# Altium project ICSL Receiver gede Ver2.PrjPCB
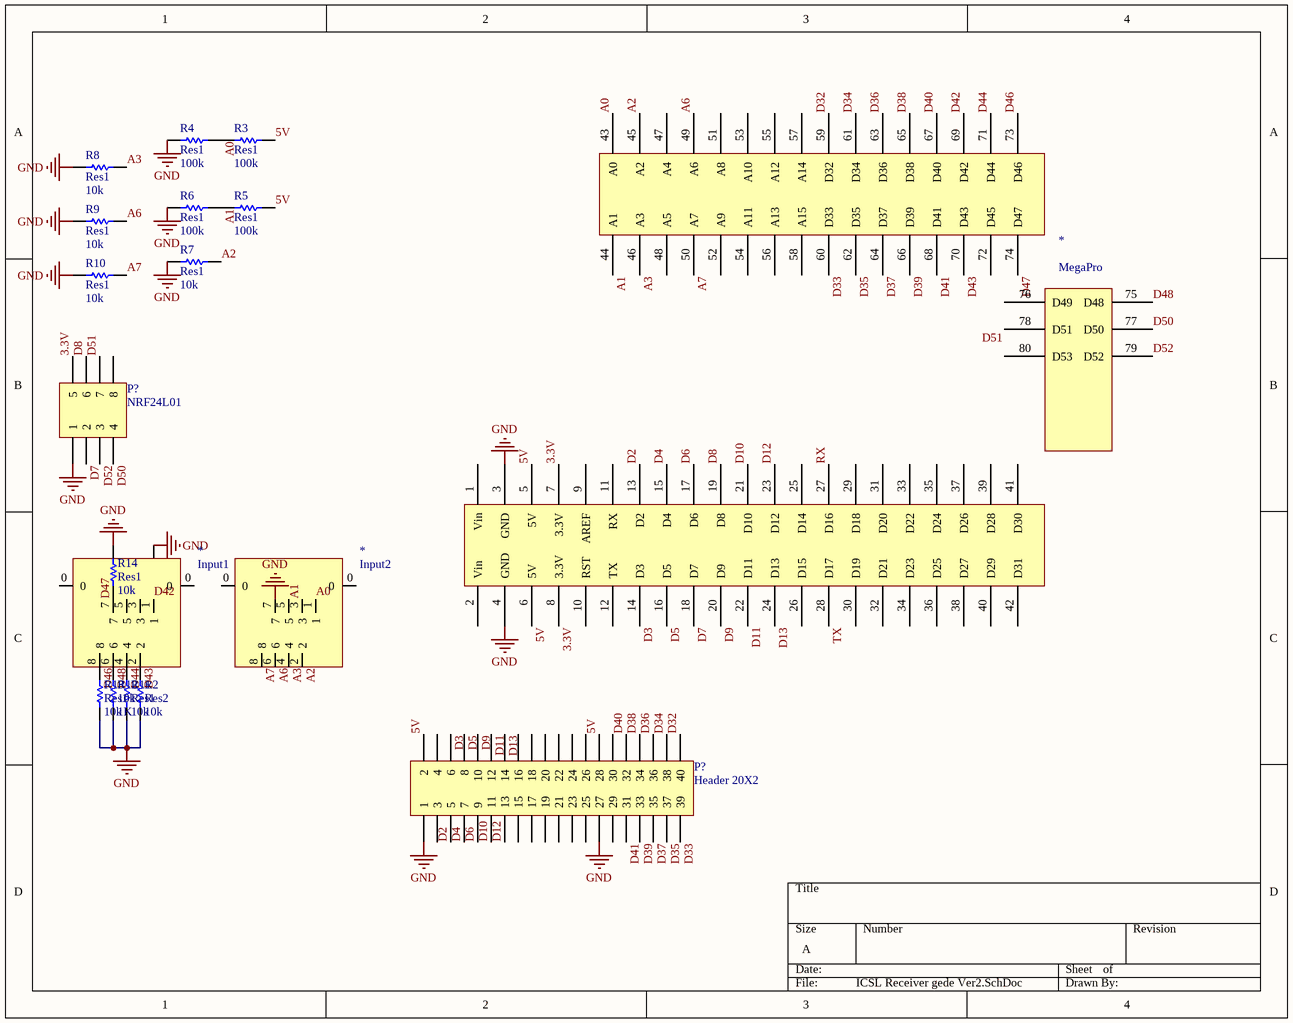
[diagram p0: ICSL Receiver gede Ver2.SchDoc]
1 sheet, 19 parts. Net scope: global (net labels, ports and power ports of the same name join across sheets).
Board file: ICSL Receiver gede Ver2.PcbDoc

## Sheet ICSL Receiver gede Ver2.SchDoc
size A; PageSetup: Record=PageOptions|CenterHorizontal=True|CenterVertical=True|PrintScale=1.00|XCorrection=1.00|YCorrection=1.00|PrintKind=2|BorderSize=5000000|LeftOffset=0|BottomOffset=0|Orientation=2|PaperLength=1000|PaperWidth=1000|Scale=100|PaperSource=7|PrintQuality=-3|MediaType=1|DitherType=10|PrintScaleMode=0|PaperKind=A4|PaperIndex=9

### Parts
(Parts that share a designator on the sheet are numbered #1, #2 ... from top to bottom, then left to right.)
*#1  MegaPro  [PCBComponent_1]
*#2  Input1  [PCBComponent_1]
*#3  Input2  [PCBComponent_1]
P?#1  NRF24L01  [HDR2X4_CEN]
P?#2  Header 20X2  [HDR2X20]
R1  Res1  value 10k  [AXIAL-0.3]
R2  Res2  value 10k  [AXIAL-0.3]
R3  Res1  value 100k  [AXIAL-0.3]
R4  Res1  value 100k  [AXIAL-0.3]
R5  Res1  value 100k  [AXIAL-0.3]
R6  Res1  value 100k  [AXIAL-0.3]
R7  Res1  value 10k  [AXIAL-0.3]
R8  Res1  value 10k  [AXIAL-0.3]
R9  Res1  value 10k  [AXIAL-0.3]
R10  Res1  value 10k  [AXIAL-0.3]
R11  Res1  value 10k  [AXIAL-0.3]
R12  10k  value 1K  [AXIAL-0.3]
R13  Res1  value 10k  [AXIAL-0.3]
R14  Res1  value 10k  [AXIAL-0.3]

### Nets
GND: *#1.3(GND) *#1.4(GND) *#3.7 P?#1.1 P?#2.1 P?#2.27 R1.2 R2.1 R4.2 R6.1 R7.1 R8.1 R9.1 R10.1 R11.1 R12.1 R13.1 R14.2
3.3V: *#1.7(3.3V) *#1.8(3.3V) P?#1.5
5V: *#1.5(5V) *#1.6(5V) P?#2.2 P?#2.28 R3.1 R5.2
A0: *#1.43(A0) *#3.1 R3.2 R4.1
A1: *#1.44(A1) *#3.3 R5.1 R6.2
A2: *#1.45(A2) *#3.2 R7.2
A3: *#1.46(A3) *#3.4 R8.2
A6: *#1.49(A6) *#3.6 R9.2
A7: *#1.50(A7) *#3.8 R10.2
D2: *#1.13(D2) P?#2.5
D3: *#1.14(D3) P?#2.6
D4: *#1.15(D4) P?#2.7
D5: *#1.16(D5) P?#2.8
D6: *#1.17(D6) P?#2.9
D7: *#1.18(D7) P?#1.2
D8: *#1.19(D8) P?#1.6
D9: *#1.20(D9) P?#2.10
D10: *#1.21(D10) P?#2.11
D11: *#1.22(D11) P?#2.12
D12: *#1.23(D12) P?#2.13
D13: *#1.24(D13) P?#2.14
D32: *#1.59(D32) P?#2.40
D33: *#1.60(D33) P?#2.39
D34: *#1.61(D34) P?#2.38
D35: *#1.62(D35) P?#2.37
D36: *#1.63(D36) P?#2.36
D37: *#1.64(D37) P?#2.35
D38: *#1.65(D38) P?#2.34
D39: *#1.66(D39) P?#2.33
D40: *#1.67(D40) P?#2.32
D41: *#1.68(D41) P?#2.31
D42: *#1.69(D42) *#2.1 R1.1
D43: *#1.70(D43) *#2.2 R2.2
D44: *#1.71(D44) *#2.4 R11.2
D46: *#1.73(D46) *#2.8 R13.2
D47: *#1.74(D47) *#2.7 R14.1
D48: *#1.75(D48) *#2.6 R12.2
D50: *#1.77(D50) P?#1.4
D51: *#1.78(D51) P?#1.7
D52: *#1.79(D52) P?#1.3
RX: *#1.27(D16)
TX: *#1.28(D17)

Not connected (* = marked no-connect by the designer): *#1 1(Vin) 2(Vin) 9(AREF) 10(RST) 11(RX) 12(TX) 25(D14) 26(D15) 29(D18) 30(D19) 31(D20) 32(D21) 33(D22) 34(D23) 35(D24) 36(D25) 37(D26) 38(D27) 39(D28) 40(D29) 41(D30) 42(D31) 47(A4) 48(A5) 51(A8) 52(A9) 53(A10) 54(A11) 55(A12) 56(A13) 57(A14) 58(A15) 72(D45) 76(D49) 80(D53); *#2 0 3 5; *#3 0 5; P?#1 8; P?#2 3 4 15 16 17 18 19 20 21 22 23 24 25 26 29 30

### Library data of the parts
*#1-*#3 = Component_1
P?#1 = Header 4X2A: Header, 4-Pin, Dual row; LatestRevisionDate: 17-Jul-2002; LatestRevisionNote: Re-released for DXP Platform.; Publisher: Altium Limited
P?#2 = Header 20X2: Header, 20-Pin, Dual row; LatestRevisionDate: 17-Jul-2002; LatestRevisionNote: Re-released for DXP Platform.; Publisher: Altium Limited
R1-R14 = Res1: Resistor; Published: 8-Jun-2000; LatestRevisionDate: 17-Jul-2002; LatestRevisionNote: Re-released for DXP Platform.; PackageReference: AXIAL-0.3; Publisher: Altium Limited; PackageDescription: Axial Device, Thru-Hole; 2 Leads; 0.3 in Pin Spacing